# Altium schematic sheet 01_模块结构图.SchDoc
size A4; DocumentNumber: 1; SheetNumber: 1; SheetTotal: 4
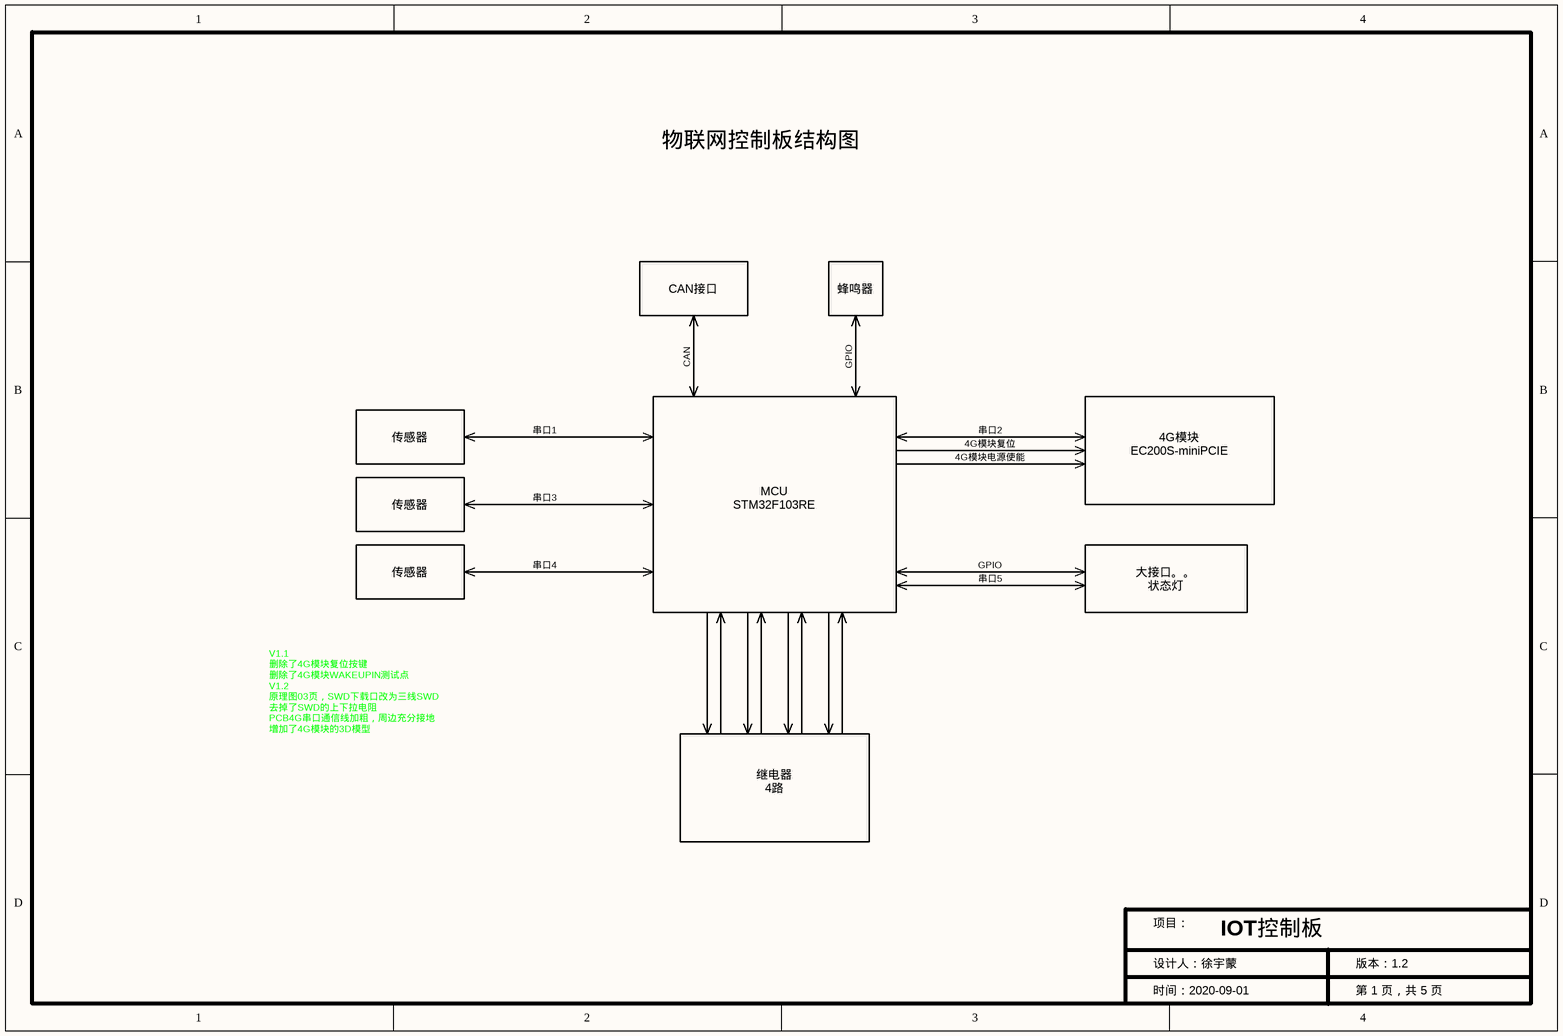
[diagram p0: 01_模块结构图.SchDoc]

## Notes on the sheet
- 物联网控制板结构图
- CAN接口
- 蜂鸣器
- CAN
- GPIO
- 传感器
- 串口1
- 串口2
- 4G模块复位
- 4G模块
- EC200S-miniPCIE
- 串口3
- MCU
- STM32F103RE
- 4G模块电源使能
- 串口4
- 串口5
- 大接口。。
- 状态灯
- 继电器
- 4路
- V1.1
  删除了4G模块复位按键
  删除了4G模块WAKEUPIN测试点
  V1.2
  原理图03页，SWD下载口改为三线SWD
  去掉了SWD的上下拉电阻
  PCB4G串口通信线加粗，周边充分接地
  增加了4G模块的3D模型
- 项目：
- IOT控制板
- 时间：2020-09-01
- 设计人：徐宇蒙
- 第 1 页，共 5 页
- 版本：1.2